# EAGLE design RS14-ActPCB (EAGLE 6.5.0)
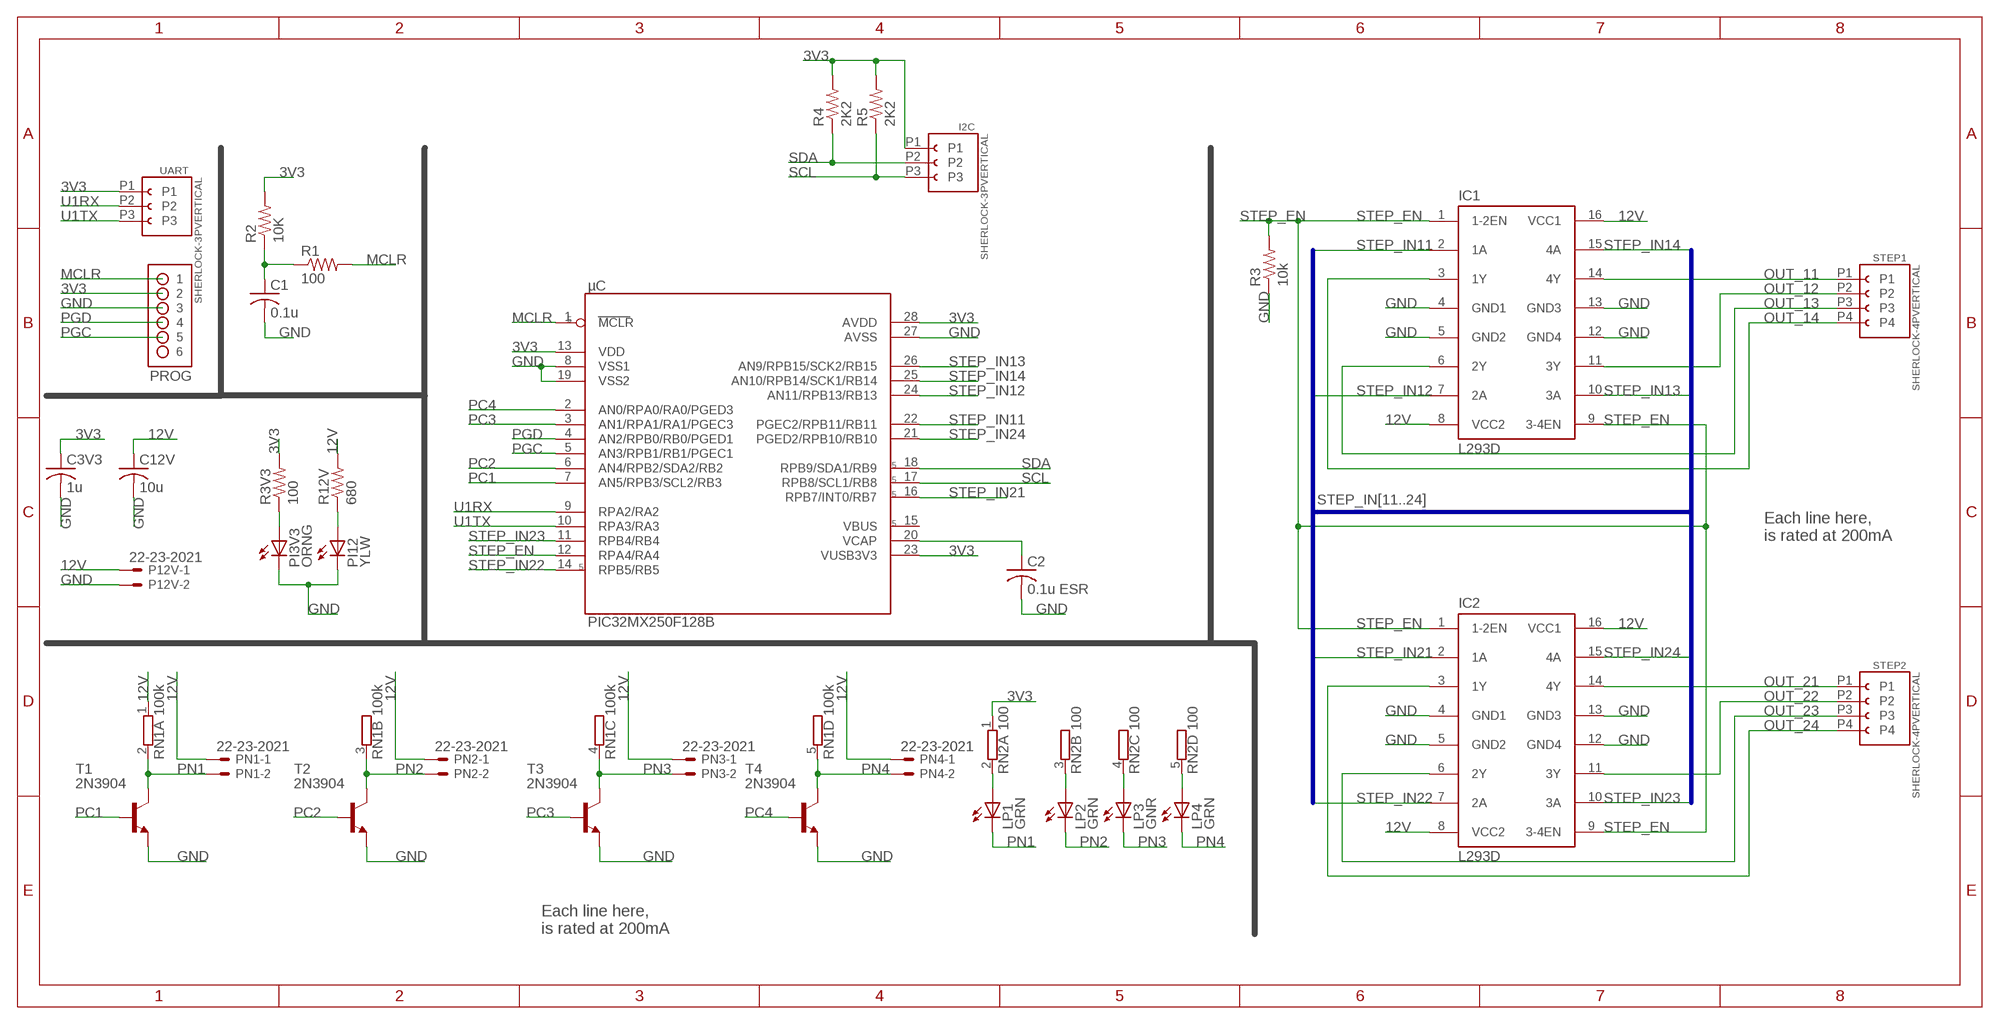
[diagram p0: schematic, sheet 1]

## Parts
C1  0.1u  C-US025-025X050  [C025-025X050]
C2  0.1u ESR  C-US025-025X050  [C025-025X050]
C3V3  1u  C-US025-025X050  [C025-025X050]
C12V  10u  C-US025-060X050  [C025-060X050]
I2C  SHERLOCK-3PVERTICAL  [35362-03**]
IC1  L293D  [DIL16]
IC2  L293D  [DIL16]
LP1  GRN  LED3MM  [LED3MM]
LP2  GRN  LED3MM  [LED3MM]
LP3  GNR  LED3MM  [LED3MM]
LP4  GRN  LED3MM  [LED3MM]
P12V  22-23-2021  [22-23-2021]
PI3V3  ORNG  LED3MM  [LED3MM]
PI12  YLW  LED3MM  [LED3MM]
PN1  22-23-2021  [22-23-2021]
PN2  22-23-2021  [22-23-2021]
PN3  22-23-2021  [22-23-2021]
PN4  22-23-2021  [22-23-2021]
PROG  HDR-1X6-OFFSET  [HDR-1X6_OFFSET]
R1  100  R-US_0204/7  [0204/7]
R2  10K  R-US_0204/7  [0204/7]
R3  10k  R-US_0204/7  [0204/7]
R3V3  100  R-US_0204/7  [0204/7]
R4  2K2  R-US_0204/7  [0204/7]
R5  2K2  R-US_0204/7  [0204/7]
R12V  680  R-US_0204/7  [0204/7]
RN1  100k  GE04R  [SIL5]
RN2  100  GE04R  [SIL5]
STEP1  SHERLOCK-4PVERTICAL  [35362-04**]
STEP2  SHERLOCK-4PVERTICAL  [35362-04**]
T1  2N3904  [TO92]
T2  2N3904  [TO92]
T3  2N3904  [TO92]
T4  2N3904  [TO92]
UART  SHERLOCK-3PVERTICAL  [35362-03**]
µC  PIC32MX250F128B  PIC32MX250F128B-I/SP  [DIP254P762X508-28]

## Nets
3V3: C3V3.1 I2C.P1 PROG.2 R2.2 R3V3.2 R4.2 R5.2 RN2.1 UART.P1 µC.13(VDD) µC.23(VUSB3V3) µC.28(AVDD)
12V: C12V.1 IC1.8(VCC2) IC1.16(VCC1) IC2.8(VCC2) IC2.16(VCC1) P12V.1 PN1.1 PN2.1 PN3.1 PN4.1 R12V.2 RN1.1
GND: C1.2 C2.2 C3V3.2 C12V.2 IC1.4(GND1) IC1.5(GND2) IC1.12(GND4) IC1.13(GND3) IC2.4(GND1) IC2.5(GND2) IC2.12(GND4) IC2.13(GND3) P12V.2 PI3V3.K(C) PI12.K(C) PROG.3 R3.1 T1.3(E) T2.3(E) T3.3(E) T4.3(E) µC.8(VSS1) µC.19(VSS2) µC.27(AVSS)
MCLR: PROG.1 R1.2 µC.1(MCLR)
N$2: C2.1 µC.20(VCAP)
N$4: LP1.A RN2.2
N$5: PI12.A R12V.1
N$6: C1.1 R1.1 R2.1
N$7: PI3V3.A R3V3.1
N$8: LP2.A RN2.3
N$9: LP3.A RN2.4
N$10: LP4.A RN2.5
OUT_11: IC1.14(4Y) STEP1.P1
OUT_12: IC1.11(3Y) STEP1.P2
OUT_13: IC1.6(2Y) STEP1.P3
OUT_14: IC1.3(1Y) STEP1.P4
OUT_21: IC2.14(4Y) STEP2.P1
OUT_22: IC2.11(3Y) STEP2.P2
OUT_23: IC2.6(2Y) STEP2.P3
OUT_24: IC2.3(1Y) STEP2.P4
PC1: T1.2(B) µC.7(AN5/RPB3/SCL2/RB3)
PC2: T2.2(B) µC.6(AN4/RPB2/SDA2/RB2)
PC3: T3.2(B) µC.3(AN1/RPA1/RA1/PGEC3)
PC4: T4.2(B) µC.2(AN0/RPA0/RA0/PGED3)
PGC: PROG.5 µC.5(AN3/RPB1/RB1/PGEC1)
PGD: PROG.4 µC.4(AN2/RPB0/RB0/PGED1)
PN1: LP1.K(C) PN1.2 RN1.2 T1.1(C)
PN2: LP2.K(C) PN2.2 RN1.3 T2.1(C)
PN3: LP3.K(C) PN3.2 RN1.4 T3.1(C)
PN4: LP4.K(C) PN4.2 RN1.5 T4.1(C)
SCL: I2C.P3 R5.1 µC.17(RPB8/SCL1/RB8)
SDA: I2C.P2 R4.1 µC.18(RPB9/SDA1/RB9)
STEP_EN: IC1.1(1-2EN) IC1.9(3-4EN) IC2.1(1-2EN) IC2.9(3-4EN) R3.2 µC.12(RPA4/RA4)
STEP_IN11: IC1.2(1A) µC.22(PGEC2/RPB11/RB11)
STEP_IN12: IC1.7(2A) µC.24(AN11/RPB13/RB13)
STEP_IN13: IC1.10(3A) µC.26(AN9/RPB15/SCK2/RB15)
STEP_IN14: IC1.15(4A) µC.25(AN10/RPB14/SCK1/RB14)
STEP_IN21: IC2.2(1A) µC.16(RPB7/INT0/RB7)
STEP_IN22: IC2.7(2A) µC.14(RPB5/RB5)
STEP_IN23: IC2.10(3A) µC.11(RPB4/RB4)
STEP_IN24: IC2.15(4A) µC.21(PGED2/RPB10/RB10)
U1RX: UART.P2 µC.9(RPA2/RA2)
U1TX: UART.P3 µC.10(RPA3/RA3)
Unconnected: PROG.6 µC.15(VBUS)

## Buses
STEP_IN[11..24]

## Notes on the sheet
- Each line here,
  is rated at 200mA
- Each line here,
  is rated at 200mA

## Library data of the parts
C1 C2 C3V3 C12V = rcl:C-US: CAPACITOR, American symbol
I2C UART = rs-molex-sherlock:SHERLOCK-3P: 3-pin Molex SherlockTM connector system Verticle 35362-03** Right Angle 35363-036** Mates with: 35507-0300 header 50212-8100 pins Use 63819-0500 crimper, and 57105-6000 pin extraction tool.
IC1 IC2 = st-microelectronics:L293D: PUSH-PULL 4 CHANNEL DRIVER; MPN: L293D; OC_FARNELL: 9589619; OC_NEWARK: 56P8249
LP1-LP4 PI3V3 PI12 = led:LED: LED OSRAM: - CHIPLED LG R971, LG N971, LY N971, LG Q971, LY Q971, LO R971, LY R971 LH N974, LH R974 LS Q976, LO Q976, LY Q976 LO Q996 - Hyper CHIPLED LW Q18S LB Q993, LB Q99A, LB R99A - SideLED LS A670, LO A670, LY A670, LG A670, LP A670 LB A673, LV A673, LT A673, LW A673 LH A674 LY A675 LS A676, LA A676, LO A676, LY A676, LW A676 LS A679, LY A679, LG A679 - Hyper Micro SIDELED® LS Y876, LA Y876, LO Y876, LY Y876 LT Y87S - SmartLED LW L88C, LW L88S LB L89C, LB L89S, LG L890 LS L89K, LO L89K, LY L89K LS L896, LA L896, LO L896, LY L896 - TOPLED LS T670, LO T670, LY T670, LG T670, LP T670 LSG T670, LSP T670, LSY T670, LOP T670, LYG T670 LG T671, LOG T671, LSG T671 LB T673, LV T673, LT T673, LW T673 LH T674 LS T676, LA T676, LO T676, LY T676, LB T676, LH T676, LSB T676, LW T676 LB T67C, LV T67C, LT T67C, LS T67K, LO T67K, LY T67K, LW E67C LS E67B, LA E67B, LO E67B, LY E67B, LB E67C, LV E67C, LT E67C LW T67C LS T679, LY T679, LG T679 LS T770, LO T770, LY T770, LG T770, LP T770 LB T773, LV T773, LT T773, LW T773 LH T774 LS E675, LA E675, LY E675, LS T675 LS T776, LA T776, LO T776, LY T776, LB T776 LHGB T686 LT T68C, LB T68C - Hyper Mini TOPLED® LB M676 - Mini TOPLED Santana® LG M470 LS M47K, LO M47K, LY M47K Source: http://www.osram.convergy.de LUXEON: - LUMILED® LXK2-PW12-R00, LXK2-PW12-S00, LXK2-PW14-U00, LXK2-PW14-V00 LXK2-PM12-R00, LXK2-PM12-S00, LXK2-PM14-U00 LXK2-PE12-Q00, LXK2-PE12-R00, LXK2-PE12-S00, LXK2-PE14-T00, LXK2-PE14-U00 LXK2-PB12-K00, LXK2-PB12-L00, LXK2-PB12-M00, LXK2-PB14-N00, LXK2-PB14-P00, LXK2-PB14-Q00 LXK2-PR12-L00, LXK2-PR12-M00, LXK2-PR14-Q00, LXK2-PR14-R00 LXK2-PD12-Q00, LXK2-PD12-R00, LXK2-PD12-S00 LXK2-PH12-R00, LXK2-PH12-S00 LXK2-PL12-P00, LXK2-PL12-Q00, LXK2-PL12-R00 Source: www.luxeon.com KINGBRIGHT: KA-3528ASYC Source: www.kingbright.com
P12V PN1-PN4 = con-molex:22-23-2021: .100" (2.54mm) Center Header - 2 Pin; MF: MOLEX; MPN: 22-23-2021; OC_FARNELL: 1462926; OC_NEWARK: 25C3832
PROG = rs-extra-cons:HDR-1X6-OFFSET: 42 mil hole pattern with 16mil offset for jtag connector
R1-R3 R3V3 R4 R5 R12V = rcl:R-US_: RESISTOR, American symbol
RN1 RN2 = resistor-sil:GE04R: SIL RESISTOR; OC_FARNELL: unknown; OC_NEWARK: unknown
STEP1 STEP2 = rs-molex-sherlock:SHERLOCK-4P: 4-pin Molex SherlockTM connector system Verticle 35362-04** Right Angle 35363-046** Mates with: 35507-0400 header 50212-8100 pins Use 63819-0500 crimper, and 57105-6000 pin extraction tool.
T1-T4 = transistor:2N3904: NPN TRANSISTOR
µC = Microchip_By_element14_Batch_1:PIC32MX250F128B-I/SP

## Board
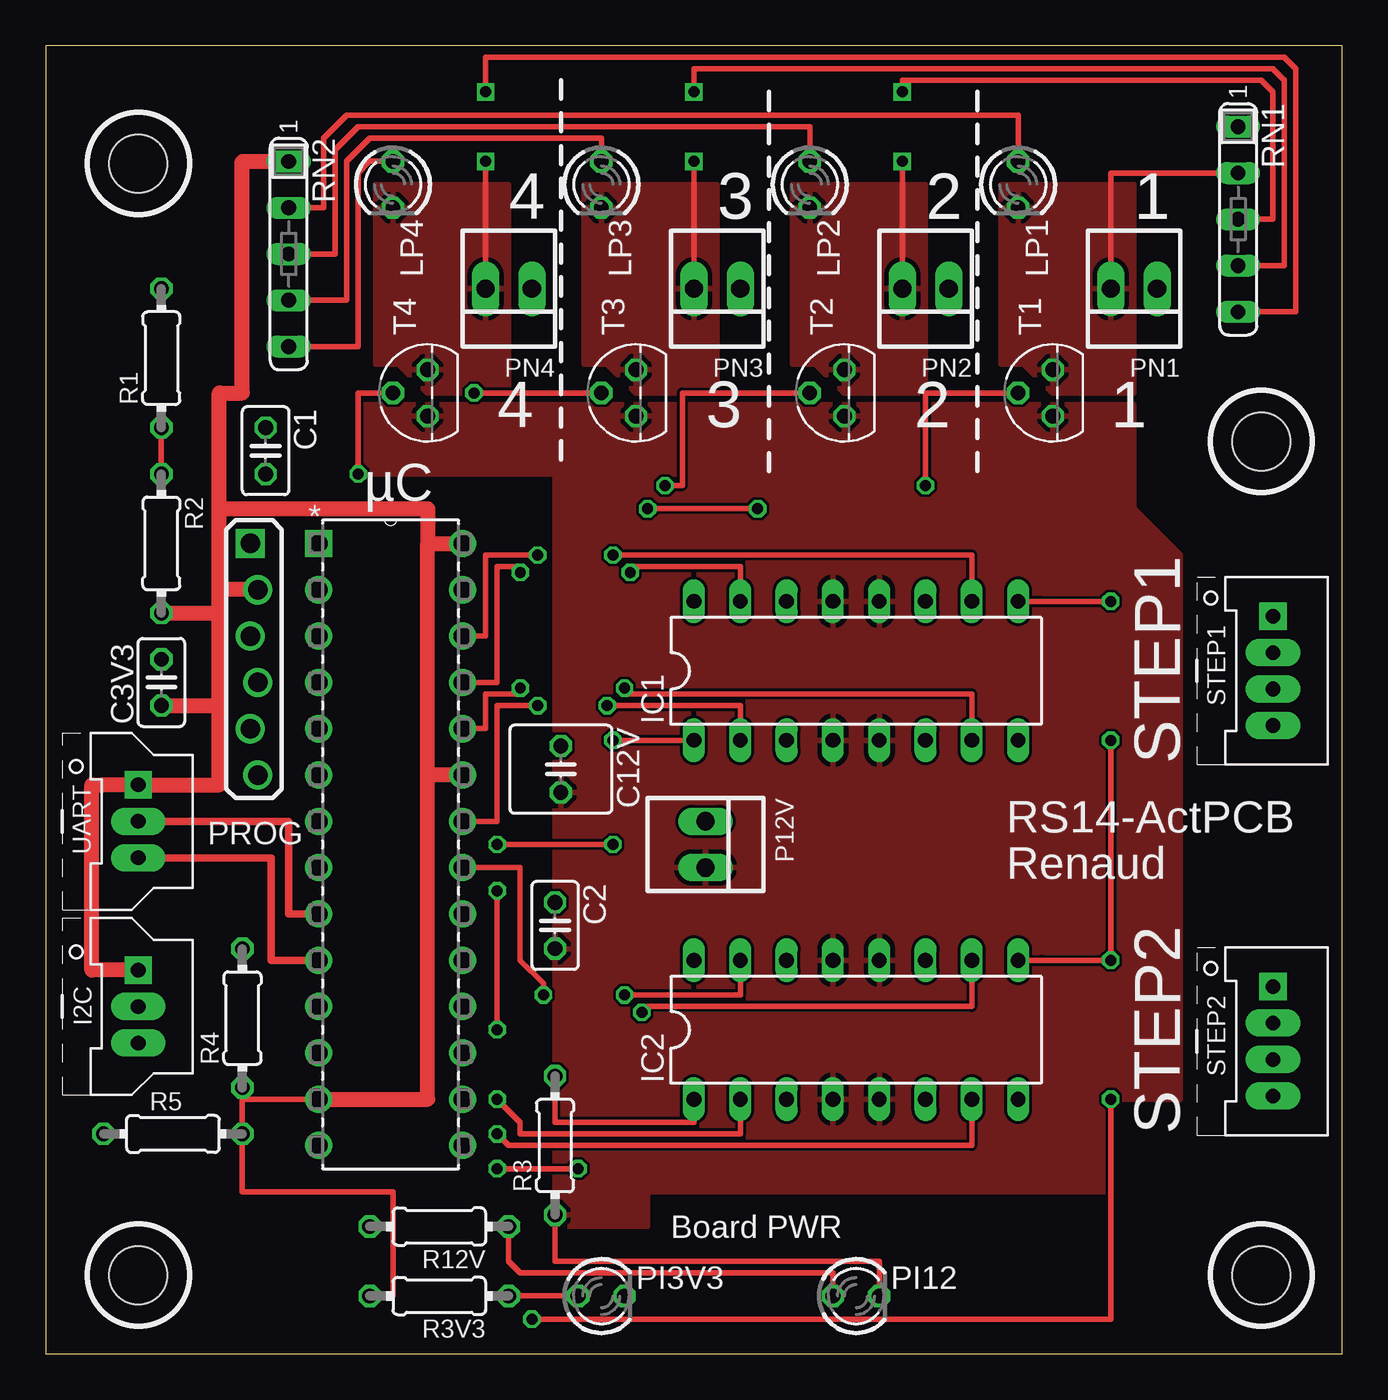
[diagram p1: board, top side]
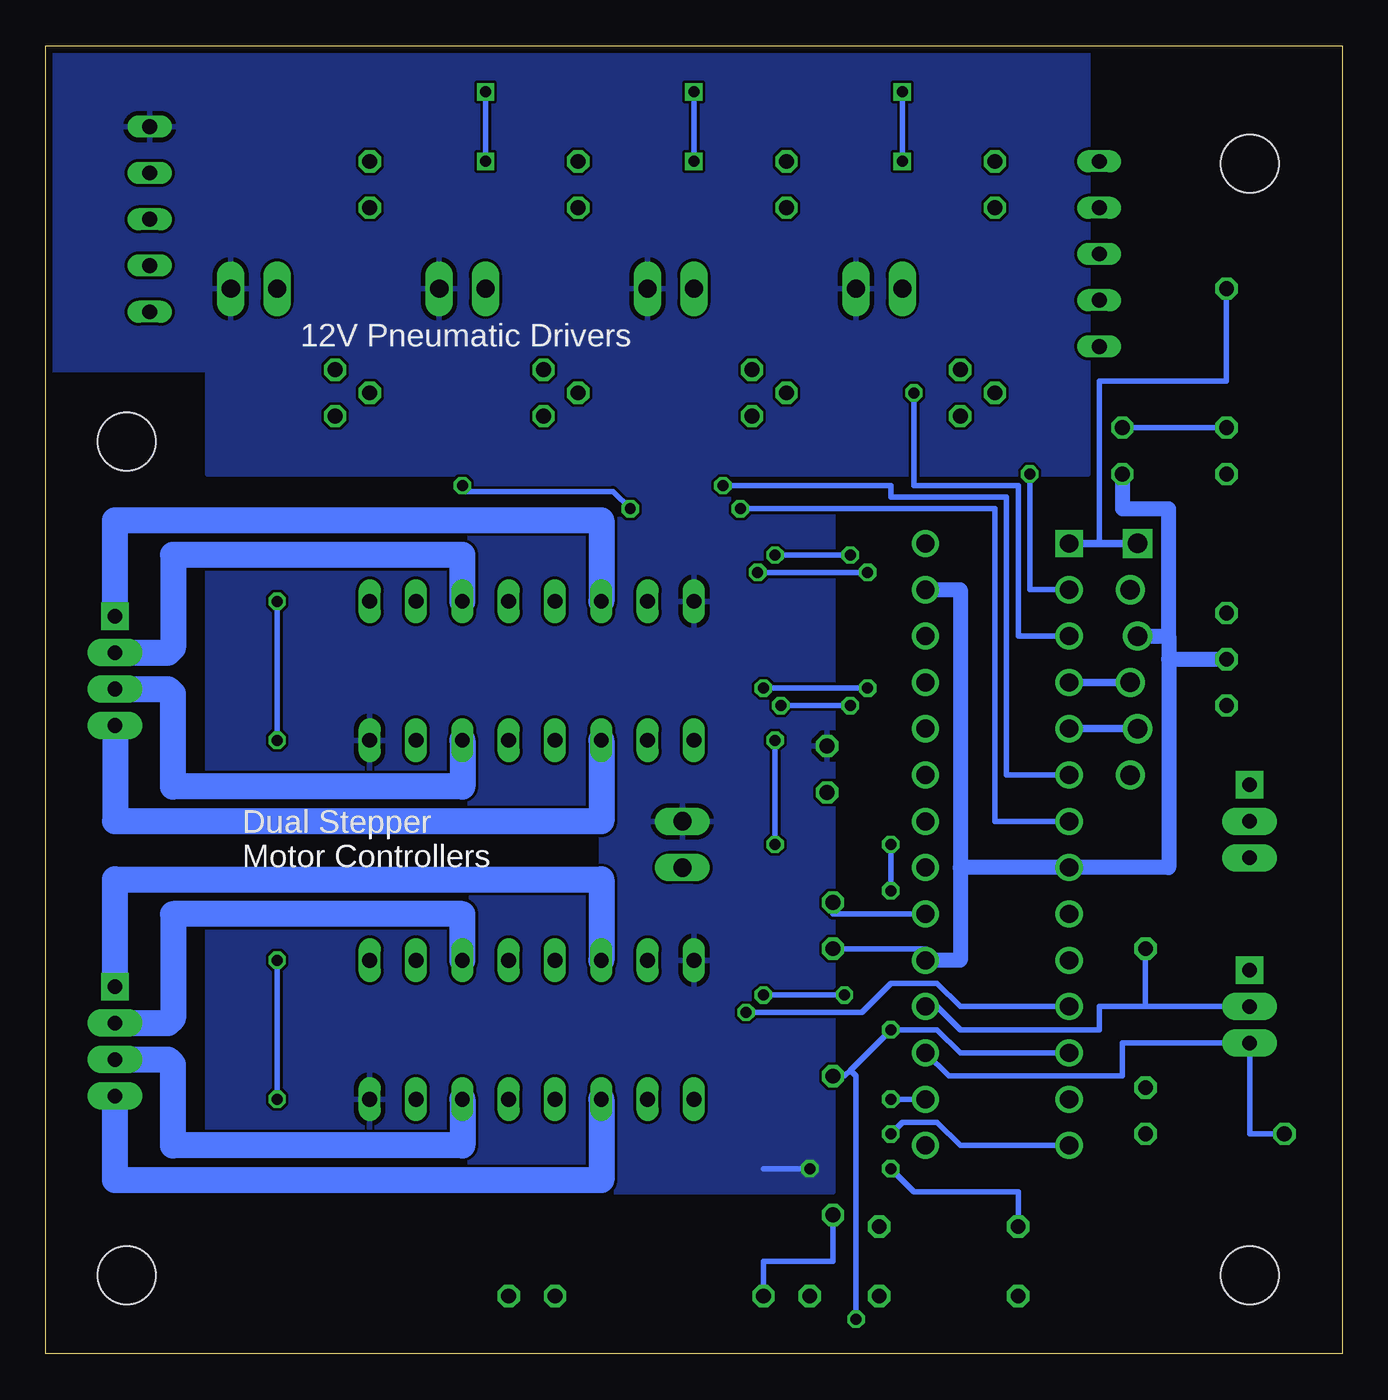
[diagram p2: board, bottom side, seen from below]

Size 71.12 x 71.75 mm. Coordinates in mm from the lower left corner, seen from the top.
Outline: 0,0 71.12,0 71.12,71.75 0,71.75 0,0
Copper layers (1*16): Top 0.0356mm / dielectric 1.5011mm / Bottom 0.0356mm
Design rules "LaenPCBOrder": minimum track width 6mil, minimum drill 13mil, track to track 6mil, track to pad 6mil, pad to pad 6mil, via to via 6mil, smd to smd 6mil, copper to edge 15mil, drill to drill 6mil, minimum pad ring 7mil, minimum via ring 7mil, stop-mask expansion 4mil, vias tented up to drill 0mil, thermal gap 10mil
Holes 3.17 mm at 66.67,4.32 66.67,50.04 5.08,4.32 5.08,65.28

### Footprints (pad centres in the part's own frame; a part is rotated, then mirrored left to right if it is on the bottom)
C025-025X050 = drill 0.813 octagon: 1 -1.27,0; 2 1.27,0
C025-060X050 = drill 0.813 octagon: 1 -1.27,0; 2 1.27,0
35362-03** = drill 0.8 pad 1.5 square: P1 -2,0 | drill 0.8 pad 1.5 long: P2 0,0; P3 2,0
DIL16 = drill 0.813 long: 1 -8.89,-3.81; 2 -6.35,-3.81; 3 -3.81,-3.81; 4 -1.27,-3.81; 5 1.27,-3.81; 6 3.81,-3.81; 7 6.35,-3.81; 8 8.89,-3.81; 9 8.89,3.81; 10 6.35,3.81; 11 3.81,3.81; 12 1.27,3.81; 13 -1.27,3.81; 14 -3.81,3.81; 15 -6.35,3.81; 16 -8.89,3.81
LED3MM = drill 0.813 octagon: A -1.27,0; K 1.27,0
22-23-2021 = drill 1 long: 1 -1.27,0; 2 1.27,0
HDR-1X6_OFFSET = drill 1.067 square: 1 -0.203,6.35 | drill 1.067: 2 0.203,3.81; 3 -0.203,1.27; 4 0.203,-1.27; 5 -0.203,-3.81; 6 0.203,-6.35
0204/7 = drill 0.813 octagon: 1 -3.81,0; 2 3.81,0
SIL5 = drill 0.813 long: 1 -5.08,0; 2 -2.54,0; 3 0,0; 4 2.54,0; 5 5.08,0
35362-04** = drill 0.8 pad 1.5 square: P1 -3,0 | drill 0.8 pad 1.5 long: P2 -1,0; P3 1,0; P4 3,0
TO92 = drill 0.813 octagon: 1 1.27,0; 2 0,1.905; 3 -1.27,0
DIP254P762X508-28 = drill 0.991 square: 1 -7.874,33.02 | drill 0.991: 2 -7.874,30.48; 3 -7.874,27.94; 4 -7.874,25.4; 5 -7.874,22.86; 6 -7.874,20.32; 7 -7.874,17.78; 8 -7.874,15.24; 9 -7.874,12.7; 10 -7.874,10.16; 11 -7.874,7.62; 12 -7.874,5.08; 13 -7.874,2.54; 14 -7.874,0; 15 0,0; 16 0,2.54; 17 0,5.08; 18 0,7.62; 19 0,10.16; 20 0,12.7; 21 0,15.24; 22 0,17.78; 23 0,20.32; 24 0,22.86; 25 0,25.4; 26 0,27.94; 27 0,30.48; 28 0,33.02

### Placement (x,y rotation side)
C1  12.06,49.53 270 top
C2  27.94,23.5 270 top
C3V3  6.35,36.83 90 top
C12V  28.26,32.07 270 top
I2C  5.08,19.05 270 top
IC1  44.45,37.47 0 top
IC2  44.45,17.78 0 top
LP1  53.34,64.13 270 top
LP2  41.91,64.13 270 top
LP3  30.48,64.13 270 top
LP4  19.05,64.13 270 top
P12V  36.2,27.94 270 top
PI3V3  30.48,3.18 0 top
PI12  44.45,3.18 0 top
PN1  59.69,58.42 180 top
PN2  48.26,58.42 180 top
PN3  36.83,58.42 180 top
PN4  25.4,58.42 180 top
PROG  11.43,38.1 0 top
R1  6.35,54.61 90 top
R2  6.35,44.45 270 top
R3  27.94,11.43 90 top
R3V3  21.59,3.18 180 top
R4  10.79,18.41 270 top
R5  6.99,12.07 0 top
R12V  21.59,6.98 180 top
RN1  65.41,62.23 270 top
RN2  13.33,60.33 270 top
STEP1  67.31,37.47 270 top
STEP2  67.31,17.14 270 top
T1  55.25,52.7 90 top
T2  43.82,52.7 90 top
T3  32.39,52.7 90 top
T4  20.95,52.7 90 top
UART  5.08,29.21 270 top
µC  22.86,11.43 0 top

### Tracks (layer width: path | path; a pad name or v marks a point on that pad's centre or on a via)
3V3
  Top 0.305: 10.79,13.97 R5.2 10.79,8.89 19.05,8.89 19.05,3.18 R3V3.2 | µC.13 10.79,13.97 | 10.79,13.97 R4.2
  Top 0.813: µC.13 20.95,13.97 20.95,31.75 | 20.95,31.75 20.95,44.45 | 20.95,44.45 µC.28 | µC.23 20.95,31.75 | PROG.2 9.52,41.91 | 9.52,41.91 9.52,46.36 | 9.52,46.36 20.95,46.36 20.95,44.45 | 9.52,35.56 9.52,40.64 | 9.52,40.64 9.52,41.91 | C3V3.1 9.52,35.56 | R2.2 9.52,40.64 | 9.52,46.36 9.52,52.7 10.79,52.7 10.79,65.41 RN2.1 | 9.52,35.56 9.52,31.21 UART.P1 3.17,31.21 2.54,31.21 2.54,21.05 I2C.P1
12V  (via drill 0.6)
  Top 0.305: v24.76,10.16 v29.21,10.16
  Bottom 0.305: R12V.2 17.78,8.89 23.49,8.89 v24.76,10.16 | v29.21,10.16 31.75,10.16
  pour Bottom: 13.97,48.26 62.23,48.26 62.23,53.97 71.12,53.97 71.12,71.75 13.97,71.75
  pour Bottom: 62.23,8.89 62.23,26.67 40.64,26.67 40.64,28.57 62.23,28.57 62.23,48.26 27.94,48.26 27.94,8.89
GND
  Top 0.305: PI12.K 45.72,5.08 27.94,5.08 R3.1
  Bottom 0.305: C2.2 22.86,22.22 µC.19 | R3.1 27.94,5.08 31.75,5.08 PI3V3.K
  Bottom 0.813: 20.95,26.67 µC.8 9.52,26.67 9.52,38.1 | 20.95,26.67 20.95,21.59 µC.19 | µC.27 20.95,41.91 20.95,26.67 | 9.52,39.37 9.52,38.1 | 9.52,38.1 C3V3.2 | PROG.3 9.52,39.37 | 9.52,39.37 9.52,46.36 12.06,46.36 C1.2
  pour Top: 59.69,48.26 27.94,48.26 27.94,6.98 33.02,6.98 33.02,8.89 58.42,8.89 58.42,13.97 62.23,13.97 62.23,43.81 59.69,46.36
  pour Top: 59.69,52.07 17.14,52.07 17.14,48.26 59.69,48.26
MCLR
  Bottom 0.305: 13.33,44.45 13.33,53.34 6.35,53.34 R1.2
  Bottom 0.406: µC.1 13.33,44.45 PROG.1
N$2
  Bottom 0.305: C2.1 27.94,24.13 µC.20
N$4
  Top 0.305: RN2.2 15.24,62.86 15.24,66.67 16.51,67.94 53.34,67.94 LP1.A
N$5
  Top 0.305: PI12.A 43.18,4.45 26.04,4.45 25.4,5.08 R12V.1
N$6
  Top 0.305: R2.1 R1.1
  Bottom 0.305: C1.1 R1.1
N$7
  Top 0.305: R3V3.1 PI3V3.A
N$8
  Top 0.305: RN2.3 15.88,60.33 15.88,66.04 17.14,67.31 41.91,67.31 LP2.A
N$9
  Top 0.305: LP3.A 30.48,66.67 17.78,66.67 16.51,65.41 16.51,57.78 RN2.4
N$10
  Top 0.305: LP4.A 17.78,65.41 17.14,64.77 17.14,55.24 RN2.5
OUT_11
  Bottom 1.422: STEP1.P1 67.31,45.72 40.64,45.72 IC1.14
OUT_12
  Bottom 1.422: STEP1.P2 64.41,38.47 64.13,38.73 64.13,43.81 48.26,43.81 IC1.11
OUT_13
  Bottom 1.422: STEP1.P3 64.41,36.47 64.13,36.2 64.13,31.11 48.26,31.11 IC1.6
OUT_14
  Bottom 1.422: STEP1.P4 67.31,29.21 40.64,29.21 IC1.3
OUT_21
  Bottom 1.422: STEP2.P1 67.31,26.04 40.64,26.04 IC2.14
OUT_22
  Bottom 1.422: IC2.11 48.26,24.13 64.13,24.13 64.13,18.41 64.41,18.14 STEP2.P2
OUT_23
  Bottom 1.422: IC2.6 48.26,11.43 64.13,11.43 64.13,15.88 64.41,16.14 STEP2.P3
OUT_24
  Bottom 1.422: IC2.3 40.64,9.53 67.31,9.53 STEP2.P4
PC1  (via drill 0.6)
  Top 0.305: T1.2 48.26,52.7 v48.26,47.62 | v39.05,46.36 v33.02,46.36
  Bottom 0.305: µC.7 19.05,29.21 19.05,46.36 v33.02,46.36 | v48.26,47.62 48.26,47.31 40.01,47.31 v39.05,46.36
PC2  (via drill 0.6)
  Top 0.305: v33.97,47.62 34.93,47.62 34.93,52.7 T2.2
  Bottom 0.305: µC.6 18.41,31.75 18.41,46.99 24.76,46.99 24.76,47.62 v33.97,47.62
PC3  (via drill 0.6)
  Top 0.305: T3.2 v23.49,52.7
  Bottom 0.305: µC.3 17.78,39.37 17.78,47.62 23.49,47.62 v23.49,52.7
PC4  (via drill 0.6)
  Top 0.305: v17.14,48.26 17.14,52.7 T4.2
  Bottom 0.305: µC.2 17.14,41.91 v17.14,48.26
PGC
  Bottom 0.406: µC.5 PROG.5
PGD
  Bottom 0.406: µC.4 PROG.4
PN1
  Top 0.305: 58.42,62.86 PN1.2 58.42,64.77 RN1.2
  pour Top: 52.39,64.13 52.39,54.29 53.66,54.29 55.25,52.7 59.69,52.7 59.69,64.13
PN2  (via drill 0.6)
  Top 0.305: RN1.3 67.31,62.23 67.31,69.22 66.67,69.85 46.99,69.85 v46.99,69.22 | v46.99,65.41 PN2.2
  Bottom 0.305: v46.99,69.22 v46.99,65.41
  pour Top: 40.96,64.13 40.96,54.29 42.23,54.29 43.82,52.7 48.26,52.7 48.26,64.13
PN3  (via drill 0.6)
  Top 0.305: RN1.4 67.94,59.69 67.94,69.85 67.31,70.48 35.56,70.48 v35.56,69.22 | v35.56,65.41 PN3.2
  Bottom 0.305: v35.56,69.22 v35.56,65.41
  pour Top: 29.53,64.13 29.53,54.29 30.8,54.29 32.39,52.7 36.83,52.7 36.83,64.13
PN4  (via drill 0.6)
  Top 0.305: RN1.5 68.58,57.15 68.58,70.48 67.94,71.12 24.13,71.12 v24.13,69.22 | v24.13,65.41 PN4.2
  Bottom 0.305: v24.13,69.22 v24.13,65.41
  pour Top: 18.1,64.13 18.1,54.29 19.37,54.29 20.95,52.7 25.4,52.7 25.4,64.13
SCL
  Bottom 0.305: µC.17 21.59,15.24 12.06,15.24 12.06,17.05 I2C.P3 5.08,12.07 R5.1
SDA
  Bottom 0.305: µC.18 22.22,19.05 20.95,17.78 13.33,17.78 13.33,19.05 10.79,19.05 | I2C.P2 10.79,19.05 | 10.79,19.05 R4.1
STEP_EN  (via drill 0.6)
  Top 0.305: 54.61,21.59 IC2.9 v58.42,21.59 v58.42,33.66 | 54.61,41.28 IC1.9 v58.42,41.28 | IC2.1 35.56,12.7 27.94,12.7 R3.2 | v58.42,13.97 58.42,1.91 v26.67,1.91 | IC1.1 v31.11,33.66 | v31.11,27.94 v24.76,27.94 | v24.76,25.4 v24.76,17.78
  Bottom 0.305: µC.12 20.95,16.51 22.22,17.78 v24.76,17.78 26.99,15.56 | 26.99,15.56 27.3,15.24 R3.2 | v58.42,21.59 v58.42,13.97 | v26.67,1.91 26.67,15.24 26.99,15.56 | v58.42,41.28 v58.42,33.66 | v31.11,33.66 v31.11,27.94 | v24.76,27.94 v24.76,25.4
STEP_IN11  (via drill 0.6)
  Top 0.305: IC1.2 38.1,35.56 v30.8,35.56 | µC.22 24.76,29.21 24.76,35.56 v26.99,35.56
  Bottom 0.305: v26.99,35.56 v30.8,35.56
STEP_IN12  (via drill 0.6)
  Top 0.305: IC1.7 50.8,36.2 32.07,36.2 v31.75,36.51 | µC.24 24.13,34.29 24.13,36.2 25.72,36.2 v26.04,36.51
  Bottom 0.305: v26.04,36.51 v31.75,36.51
STEP_IN13  (via drill 0.6)
  Top 0.305: IC1.10 50.8,43.81 v31.11,43.81 | v26.99,43.81 24.13,43.81 24.13,39.37 µC.26
  Bottom 0.305: v26.99,43.81 v31.11,43.81
STEP_IN14  (via drill 0.6)
  Top 0.305: IC1.15 38.1,43.18 32.39,43.18 v32.07,42.86 | µC.25 24.76,36.83 24.76,43.18 25.72,43.18 v26.04,42.86
  Bottom 0.305: v32.07,42.86 v26.04,42.86
STEP_IN21  (via drill 0.6)
  Top 0.305: IC2.2 38.1,12.07 26.04,12.07 26.04,12.7 v24.76,13.97
  Bottom 0.305: µC.16 v24.76,13.97
STEP_IN22  (via drill 0.6)
  Top 0.305: IC2.7 50.8,11.43 25.4,11.43 v24.76,12.07
  Bottom 0.305: µC.14 20.95,11.43 22.22,12.7 24.13,12.7 v24.76,12.07
STEP_IN23  (via drill 0.6)
  Top 0.305: IC2.10 50.8,19.05 33.02,19.05 v32.7,18.73
  Bottom 0.305: v32.7,18.73 26.35,18.73 24.76,20.32 24.13,20.32 22.22,20.32 20.95,19.05 µC.11
STEP_IN24  (via drill 0.6)
  Top 0.305: IC2.15 38.1,19.68 v31.75,19.68 | v27.3,19.68 27.3,20.32 26.04,21.59 26.04,26.67 24.76,26.67 µC.21
  Bottom 0.305: v31.75,19.68 v27.3,19.68
U1RX
  Top 0.406: µC.9 13.33,24.13 13.33,29.21 UART.P2
U1TX
  Top 0.406: µC.10 12.38,21.59 12.38,27.21 UART.P3

### Text on the board
tNames: 4 | 3 | 2 | 1 | 4 | 3 | 2 | 1 | STEP1 | RS14-ActPCB | Renaud | STEP2 | Board PWR
bNames: 12V Pneumatic Drivers | Dual Stepper / Motor Controllers